# EAGLE schematic mm_robot_pcb_v4 (EAGLE 9.6.2)
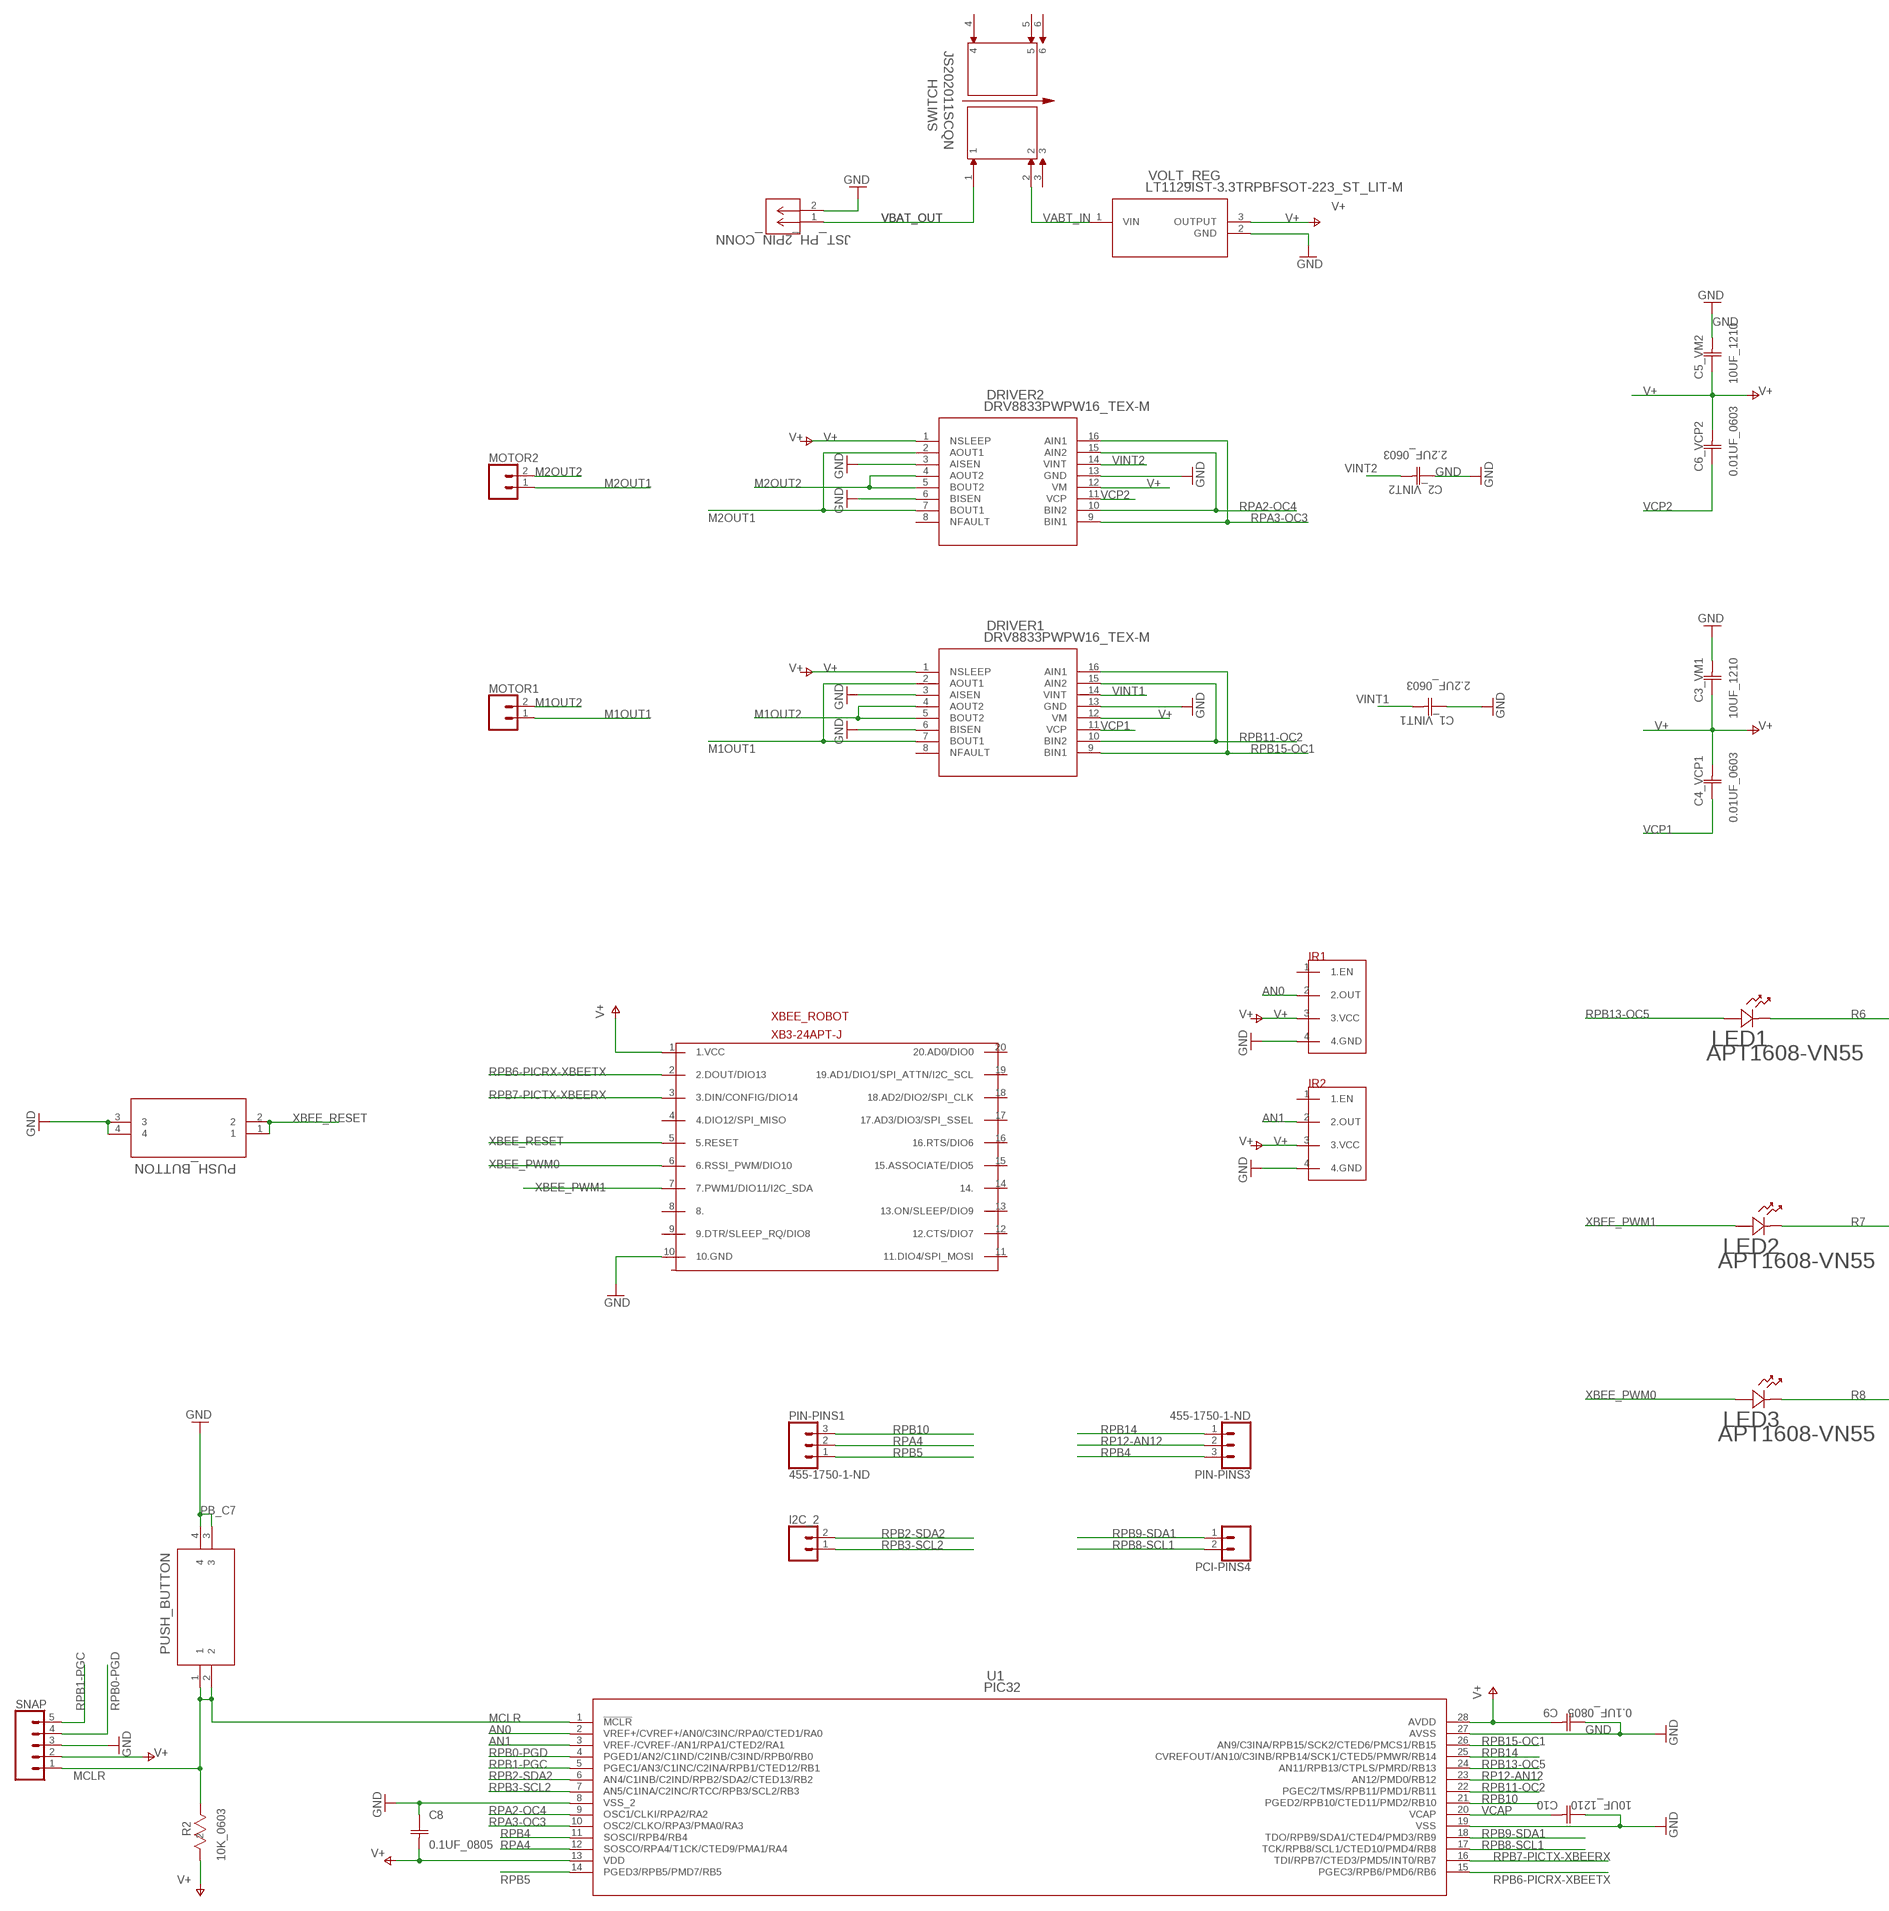
[diagram p0: schematic, sheet 1, part 1 of 2]
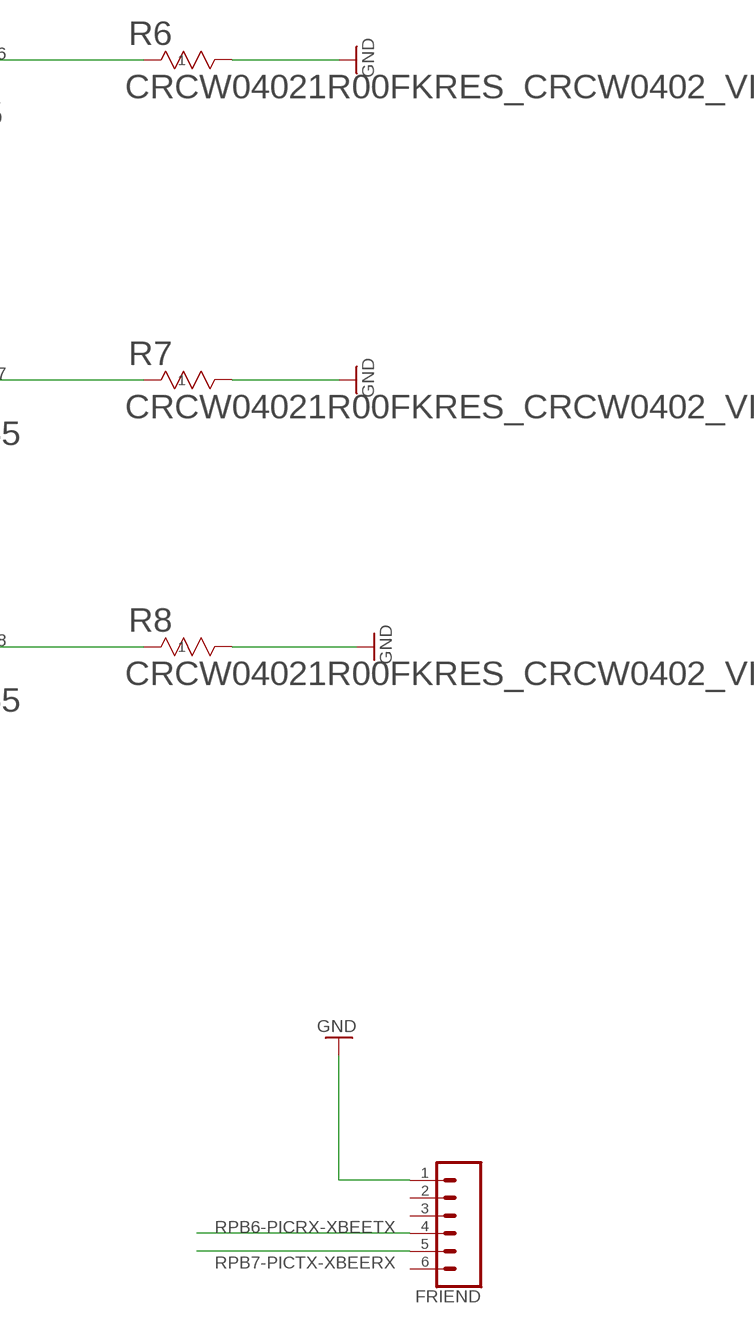
[diagram p1: schematic, sheet 1, part 2 of 2]

## Parts
C1_VINT1  2.2UF_0603  CL10A225KP8NNNCCAP_CL10_SAM-M  [CAP_CL10_SAM-M]
C2_VINT2  2.2UF_0603  CL10A225KP8NNNCCAP_CL10_SAM-M  [CAP_CL10_SAM-M]
C3_VM1  10UF_1210  TPSB106K016R0500CAP_TPS_B_AVX-M  [CAP_TPS_B_AVX-M]
C4_VCP1  0.01UF_0603  01UF_CAP  [CAP_01UF_0603_X7R_G_AVX]
C5_VM2  10UF_1210  TPSB106K016R0500CAP_TPS_B_AVX-M  [CAP_TPS_B_AVX-M]
C6_VCP2  0.01UF_0603  01UF_CAP  [CAP_01UF_0603_X7R_G_AVX]
C8  0.1UF_0805  C2012X7R2A104K125AACAP_C2012X7R2A104K125AA_TDK-M  [CAP_C2012X7R2A104K125AA_TDK-M]
C9  0.1UF_0805  C2012X7R2A104K125AACAP_C2012X7R2A104K125AA_TDK-M  [CAP_C2012X7R2A104K125AA_TDK-M]
C10  10UF_1210  TPSB106K016R0500CAP_TPS_B_AVX-M  [CAP_TPS_B_AVX-M]
DRIVER1  DRV8833PWPW16_TEX-M  [PW16_TEX-M]
DRIVER2  DRV8833PWPW16_TEX-M  [PW16_TEX-M]
FRIEND  CONN_06NO_SILK_FEMALE_PTH  [1X06_NO_SILK]
I2C_2  CONN_02  [1X02]
IR1  GP2Y0A60SZLF  [1X04]
IR2  GP2Y0A60SZLF  [1X04]
JST_PH_2PIN_CONN  1769  [CONN_1769_ADA]
LED1  APT1608-VN55  [LED_APT1608_KNB]
LED2  APT1608-VN55  [LED_APT1608_KNB]
LED3  APT1608-VN55  [LED_APT1608_KNB]
MOTOR1  CONN_02  [1X02]
MOTOR2  CONN_02  [1X02]
PCI-PINS4  CONN_02  [1X02]
PIC_PB  PUSH_BUTTON  PTS526_SK15_SMTR2_LFSSMT_FS-M  [SMT_FS-M]
PIN-PINS1  455-1750-1-ND  CONN_03  [1X03]
PIN-PINS3  455-1750-1-ND  CONN_03  [1X03]
R2  10K_0603  CRG0603F10KRES0603_CRG_TYCO_TYC-M  [RES0603_CRG_TYCO_TYC-M]
R6  CRCW04021R00FKRES_CRCW0402_VIS-M  [RES_CRCW0402_VIS-M]
R7  CRCW04021R00FKRES_CRCW0402_VIS-M  [RES_CRCW0402_VIS-M]
R8  CRCW04021R00FKRES_CRCW0402_VIS-M  [RES_CRCW0402_VIS-M]
SNAP  CONN_05  [1X05]
SWITCH  JS202011SCQN  [SW_JS202011SCQN]
U1  PIC32  PIC32MX170F256B-I/SSSSOP28_MC_MCH-M  [SSOP28_MC_MCH-M]
VOLT_REG  LT1129IST-3.3TRPBFSOT-223_ST_LIT-M  [SOT-223_ST_LIT-M]
XBEE_PB  PUSH_BUTTON  PTS526_SK15_SMTR2_LFSSMT_FS-M  [SMT_FS-M]
XBEE_ROBOT  XB3-24APT-J  [XB3-24APT-J]

## Nets
AN0: IR1.2(2.OUT) U1.2(VREF+/CVREF+/AN0/C3INC/RPA0/CTED1/RA0)
AN1: IR2.2(2.OUT) U1.3(VREF-/CVREF-/AN1/RPA1/CTED2/RA1)
GND: C1_VINT1.1 C2_VINT2.1 C3_VM1.2 C5_VM2.2 C8.1 C9.1 C10.1 DRIVER1.3(AISEN) DRIVER1.6(BISEN) DRIVER1.13(GND) DRIVER2.3(AISEN) DRIVER2.6(BISEN) DRIVER2.13(GND) FRIEND.1 IR1.4(4.GND) IR2.4(4.GND) JST_PH_2PIN_CONN.2 R6.2 R7.2 R8.2 SNAP.3 U1.8(VSS_2) U1.19(VSS) U1.27(AVSS) VOLT_REG.2(GND) XBEE_PB.3 XBEE_PB.4 XBEE_ROBOT.10(10.GND)
M1OUT1: DRIVER1.2(AOUT1) DRIVER1.7(BOUT1) MOTOR1.1
M1OUT2: DRIVER1.4(AOUT2) DRIVER1.5(BOUT2) MOTOR1.2
M2OUT1: DRIVER2.2(AOUT1) DRIVER2.7(BOUT1) MOTOR2.1
M2OUT2: DRIVER2.4(AOUT2) DRIVER2.5(BOUT2) MOTOR2.2
MCLR: PIC_PB.1 PIC_PB.2 R2.1 SNAP.1 U1.1(!MCLR)
PB_C7: PIC_PB.3 PIC_PB.4 ; supply symbol labelled GND
R6: LED1.1 R6.1
R7: LED2.1 R7.1
R8: LED3.1 R8.1
RP12-AN12: PIN-PINS3.2 U1.23(AN12/PMD0/RB12)
RPA2-OC4: DRIVER2.10(BIN2) DRIVER2.15(AIN2) U1.9(OSC1/CLKI/RPA2/RA2)
RPA3-OC3: DRIVER2.9(BIN1) DRIVER2.16(AIN1) U1.10(OSC2/CLKO/RPA3/PMA0/RA3)
RPA4: PIN-PINS1.2 U1.12(SOSCO/RPA4/T1CK/CTED9/PMA1/RA4)
RPB0-PGD: SNAP.4 U1.4(PGED1/AN2/C1IND/C2INB/C3IND/RPB0/RB0)
RPB1-PGC: SNAP.5 U1.5(PGEC1/AN3/C1INC/C2INA/RPB1/CTED12/RB1)
RPB2-SDA2: I2C_2.2 U1.6(AN4/C1INB/C2IND/RPB2/SDA2/CTED13/RB2)
RPB3-SCL2: I2C_2.1 U1.7(AN5/C1INA/C2INC/RTCC/RPB3/SCL2/RB3)
RPB4: PIN-PINS3.3 U1.11(SOSCI/RPB4/RB4)
RPB5: PIN-PINS1.1 U1.14(PGED3/RPB5/PMD7/RB5)
RPB6-PICRX-XBEETX: FRIEND.4 U1.15(PGEC3/RPB6/PMD6/RB6) XBEE_ROBOT.2(2.DOUT/DIO13)
RPB7-PICTX-XBEERX: FRIEND.5 U1.16(TDI/RPB7/CTED3/PMD5/INT0/RB7) XBEE_ROBOT.3(3.DIN/CONFIG/DIO14)
RPB8-SCL1: PCI-PINS4.2 U1.17(TCK/RPB8/SCL1/CTED10/PMD4/RB8)
RPB9-SDA1: PCI-PINS4.1 U1.18(TDO/RPB9/SDA1/CTED4/PMD3/RB9)
RPB10: PIN-PINS1.3 U1.21(PGED2/RPB10/CTED11/PMD2/RB10)
RPB11-OC2: DRIVER1.10(BIN2) DRIVER1.15(AIN2) U1.22(PGEC2/TMS/RPB11/PMD1/RB11)
RPB13-OC5: LED1.2 U1.24(AN11/RPB13/CTPLS/PMRD/RB13)
RPB14: PIN-PINS3.1 U1.25(CVREFOUT/AN10/C3INB/RPB14/SCK1/CTED5/PMWR/RB14)
RPB15-OC1: DRIVER1.9(BIN1) DRIVER1.16(AIN1) U1.26(AN9/C3INA/RPB15/SCK2/CTED6/PMCS1/RB15)
V+: C3_VM1.1 C4_VCP1.2 C5_VM2.1 C6_VCP2.2 C8.2 C9.2 DRIVER1.1(NSLEEP) DRIVER1.12(VM) DRIVER2.1(NSLEEP) DRIVER2.12(VM) IR1.3(3.VCC) IR2.3(3.VCC) R2.2 SNAP.2 U1.13(VDD) U1.28(AVDD) VOLT_REG.3(OUTPUT) XBEE_ROBOT.1(1.VCC)
VABT_IN: SWITCH.2 VOLT_REG.1(VIN)
VBAT_OUT: JST_PH_2PIN_CONN.1 SWITCH.1
VCAP: C10.2 U1.20(VCAP)
VCP1: C4_VCP1.1 DRIVER1.11(VCP)
VCP2: C6_VCP2.1 DRIVER2.11(VCP)
VINT1: C1_VINT1.2 DRIVER1.14(VINT)
VINT2: C2_VINT2.2 DRIVER2.14(VINT)
XBEE_PWM0: LED3.2 XBEE_ROBOT.6(6.RSSI_PWM/DIO10)
XBEE_PWM1: LED2.2 XBEE_ROBOT.7(7.PWM1/DIO11/I2C_SDA)
XBEE_RESET: XBEE_PB.1 XBEE_PB.2 XBEE_ROBOT.5(5.RESET)
Unconnected: DRIVER1.8(NFAULT) DRIVER2.8(NFAULT) FRIEND.2 FRIEND.3 FRIEND.6 IR1.1(1.EN) IR2.1(1.EN) SWITCH.3 SWITCH.4 SWITCH.5 SWITCH.6 XBEE_ROBOT.4(4.DIO12/SPI_MISO) XBEE_ROBOT.8(8.) XBEE_ROBOT.9(9.DTR/SLEEP_RQ/DIO8) XBEE_ROBOT.11(11.DIO4/SPI_MOSI) XBEE_ROBOT.12(12.CTS/DIO7) XBEE_ROBOT.13(13.ON/SLEEP/DIO9) XBEE_ROBOT.14(14.) XBEE_ROBOT.15(15.ASSOCIATE/DIO5) XBEE_ROBOT.16(16.RTS/DIO6) XBEE_ROBOT.17(17.AD3/DIO3/SPI_SSEL) XBEE_ROBOT.18(18.AD2/DIO2/SPI_CLK) XBEE_ROBOT.19(19.AD1/DIO1/SPI_ATTN/I2C_SCL) XBEE_ROBOT.20(20.AD0/DIO0)

## Library data of the parts
C1_VINT1 C2_VINT2 = micromouse:CL10A225KP8NNNC; COPYRIGHT: Copyright (C) 2021 Ultra Librarian. All rights reserved.; MANUFACTURER_PART_NUMBER: CL10A225KP8NNNC; MFR_NAME: Samsung
C3_VM1 C5_VM2 C10 = micromouse:TPSB106K016R0500; COPYRIGHT: Copyright (C) 2021 Ultra Librarian. All rights reserved.; MANUFACTURER_PART_NUMBER: TPSB106K016R0500; MFR_NAME: AVX Corporation
C4_VCP1 C6_VCP2 = micromouse:01UF_CAP
C8 C9 = micromouse:C2012X7R2A104K125AA; COPYRIGHT: Copyright (C) 2021 Ultra Librarian. All rights reserved.; MANUFACTURER_PART_NUMBER: C2012X7R2A104K125AA; MFR_NAME: TDK
DRIVER1 DRIVER2 = DRV8833PW:DRV8833PW; COPYRIGHT: Copyright (C) 2021 Ultra Librarian. All rights reserved.; MANUFACTURER_PART_NUMBER: DRV8833PW; MFR_NAME: Texas Instruments
FRIEND = micromouse:CONN_06: Multi connection point. Often used as Generic Header-pin footprint for 0.1 inch spaced/style header connections On any of the 0.1 inch spaced packages, you can populate with these: Break Away Headers - Straight <https://www.sparkfun.com/products/116> (PRT-00116) Break Away Male Headers - Right Angle <https://www.sparkfun.com/products/553> (PRT-00553) Female Headers <https://www.sparkfun.com/products/115> (PRT-00115) Break Away Headers - Machine Pin <https://www.sparkfun.com/products/117> (PRT-00117) Break Away Female Headers - Swiss Machine Pin <https://www.sparkfun.com/products/743> (PRT-00743) Arduino Stackable Header - 6 Pin <https://www.sparkfun.com/products/9280> (PRT-09280) For SCREWTERMINALS and SPRING TERMINALS visit here: Screw Terimnals on SparkFun.com <https://www.sparkfun.com/search/results?term=Screw+Terminals> (5mm/3.5mm/2.54mm spacing) This device is also useful as a general connection point to wire up your design to another part of your project. Our various solder wires solder well into these plated through hole pads. Hook-Up Wire - Assortment (Stranded, 22 AWG) <https://www.sparkfun.com/products/11375> (PRT-11375) Hook-Up Wire - Assortment (Solid Core, 22 AWG) <https://www.sparkfun.com/products/11367> (PRT-11367) View the entire wire category on our website here <https://www.sparkfun.com/categories/141>; PROD_ID: CONN-08437
I2C_2 MOTOR1 MOTOR2 PCI-PINS4 = micromouse:CONN_02: Multi connection point. Often used as Generic Header-pin footprint for 0.1 inch spaced/style header connections On any of the 0.1 inch spaced packages, you can populate with these: Break Away Headers - Straight <https://www.sparkfun.com/products/116> (PRT-00116) Break Away Male Headers - Right Angle <https://www.sparkfun.com/products/553> (PRT-00553) Female Headers <https://www.sparkfun.com/products/115> (PRT-00115) Break Away Headers - Machine Pin <https://www.sparkfun.com/products/117> (PRT-00117) Break Away Female Headers - Swiss Machine Pin <https://www.sparkfun.com/products/743> (PRT-00743) For SCREWTERMINALS and SPRING TERMINALS visit here: Screw Terimnals on SparkFun.com <https://www.sparkfun.com/search/results?term=Screw+Terminals> (5mm/3.5mm/2.54mm spacing) This device is also useful as a general connection point to wire up your design to another part of your project. Our various solder wires solder well into these plated through hole pads. Hook-Up Wire - Assortment (Stranded, 22 AWG) <https://www.sparkfun.com/products/11375> (PRT-11375) Hook-Up Wire - Assortment (Solid Core, 22 AWG) <https://www.sparkfun.com/products/11367> (PRT-11367) View the entire wire category on our website here <https://www.sparkfun.com/categories/141> Special notes: Molex polarized connector foot print use with: PRT-08233 with associated crimp pins and housings. 2.54_SCREWTERM for use with PRT-10571. 3.5mm Screw Terminal footprints for PRT-08084 5mm Screw Terminal footprints for use with PRT-08432
IR1 IR2 = micromouse:GP2Y0A60SZLF
JST_PH_2PIN_CONN = micromouse:1769; COPYRIGHT: Copyright (C) 2021 Ultra Librarian. All rights reserved.; MANUFACTURER_PART_NUMBER: 1769; MFR_NAME: Adafruit Industries
LED1-LED3 = micromouse:APT1608-VN55; COPYRIGHT: Copyright (C) 2021 Ultra Librarian. All rights reserved.; MANUFACTURER_PART_NUMBER: APT1608-VN55; MFR_NAME: Kingbright
PIC_PB XBEE_PB = micromouse:PTS526_SK15_SMTR2_LFS; COPYRIGHT: Copyright (C) 2021 Ultra Librarian. All rights reserved.; MANUFACTURER_PART_NUMBER: PTS526 SK15 SMTR2 LFS; MFR_NAME: C&K
PIN-PINS1 PIN-PINS3 = micromouse:CONN_03: Multi connection point. Often used as Generic Header-pin footprint for 0.1 inch spaced/style header connections On any of the 0.1 inch spaced packages, you can populate with these: Break Away Headers - Straight <https://www.sparkfun.com/products/116> (PRT-00116) Break Away Male Headers - Right Angle <https://www.sparkfun.com/products/553> (PRT-00553) Female Headers <https://www.sparkfun.com/products/115> (PRT-00115) Break Away Headers - Machine Pin <https://www.sparkfun.com/products/117> (PRT-00117) Break Away Female Headers - Swiss Machine Pin <https://www.sparkfun.com/products/743> (PRT-00743) Stackable Header - 3 Pin (Female, 0.1") <https://www.sparkfun.com/products/13875> (PRT-13875) For SCREWTERMINALS and SPRING TERMINALS visit here: Screw Terimnals on SparkFun.com <https://www.sparkfun.com/search/results?term=Screw+Terminals> (5mm/3.5mm/2.54mm spacing) This device is also useful as a general connection point to wire up your design to another part of your project. Our various solder wires solder well into these plated through hole pads. Hook-Up Wire - Assortment (Stranded, 22 AWG) <https://www.sparkfun.com/products/11375> (PRT-11375) Hook-Up Wire - Assortment (Solid Core, 22 AWG) <https://www.sparkfun.com/products/11367> (PRT-11367) View the entire wire category on our website here <https://www.sparkfun.com/categories/141> Special notes: Molex polarized connector foot print use with SKU : PRT-08232 with associated crimp pins and housings.; PROD_ID: XXX-00000
R2 = micromouse:CRG0603F10K; COPYRIGHT: Copyright (C) 2021 Ultra Librarian. All rights reserved.; MANUFACTURER_PART_NUMBER: CRG0603F10K; MFR_NAME: TE Connectivity
R6-R8 = micromouse:CRCW04021R00FK; COPYRIGHT: Copyright (C) 2021 Ultra Librarian. All rights reserved.; MANUFACTURER_PART_NUMBER: CRCW04021R00FK; MFR_NAME: Vishay
SNAP = micromouse:CONN_05: Multi connection point. Often used as Generic Header-pin footprint for 0.1 inch spaced/style header connections On any of the 0.1 inch spaced packages, you can populate with these: Break Away Headers - Straight <https://www.sparkfun.com/products/116> (PRT-00116) Break Away Male Headers - Right Angle <https://www.sparkfun.com/products/553> (PRT-00553) Female Headers <https://www.sparkfun.com/products/115> (PRT-00115) Break Away Headers - Machine Pin <https://www.sparkfun.com/products/117> (PRT-00117) Break Away Female Headers - Swiss Machine Pin <https://www.sparkfun.com/products/743> (PRT-00743) For SCREWTERMINALS and SPRING TERMINALS visit here: Screw Terimnals on SparkFun.com <https://www.sparkfun.com/search/results?term=Screw+Terminals> (5mm/3.5mm/2.54mm spacing) This device is also useful as a general connection point to wire up your design to another part of your project. Our various solder wires solder well into these plated through hole pads. Hook-Up Wire - Assortment (Stranded, 22 AWG) <https://www.sparkfun.com/products/11375> (PRT-11375) Hook-Up Wire - Assortment (Solid Core, 22 AWG) <https://www.sparkfun.com/products/11367> (PRT-11367) View the entire wire category on our website here <https://www.sparkfun.com/categories/141> Special notes: Molex polarized connector foot print use with SKU : PRT-08231 with associated crimp pins and housings. 1MM SMD Version SKU: PRT-10208
SWITCH = micromouse:JS202011SCQN; COPYRIGHT: Copyright (C) 2021 Ultra Librarian. All rights reserved.; MANUFACTURER_PART_NUMBER: JS202011SCQN; MFR_NAME: C&K
U1 = micromouse:PIC32MX170F256B-I/SS; COPYRIGHT: Copyright (C) 2021 Ultra Librarian. All rights reserved.; MANUFACTURER_PART_NUMBER: PIC32MX170F256B-I/SS; MFR_NAME: Microchip
VOLT_REG = LT1129IST-3.3#TRPBF:LT1129IST-3.3TRPBF; COPYRIGHT: Copyright (C) 2021 Ultra Librarian. All rights reserved.; MANUFACTURER_PART_NUMBER: LT1129IST-3.3#TRPBF; MFR_NAME: Analog Devices / Linear Technology
XBEE_ROBOT = micromouse:XB3-24APT-J